# Altium schematic sheet DM3390_Connector_B.SchDoc: =project_title
size Tabloid; CompanyName: Luxonis Holding; Organization: Luxonis Holding; Address1: 1925 Harmony Park Drive; Address2: Westminster, CO; Address3: 80234; Address4: United States; SheetNumber: 8; SheetTotal: 12
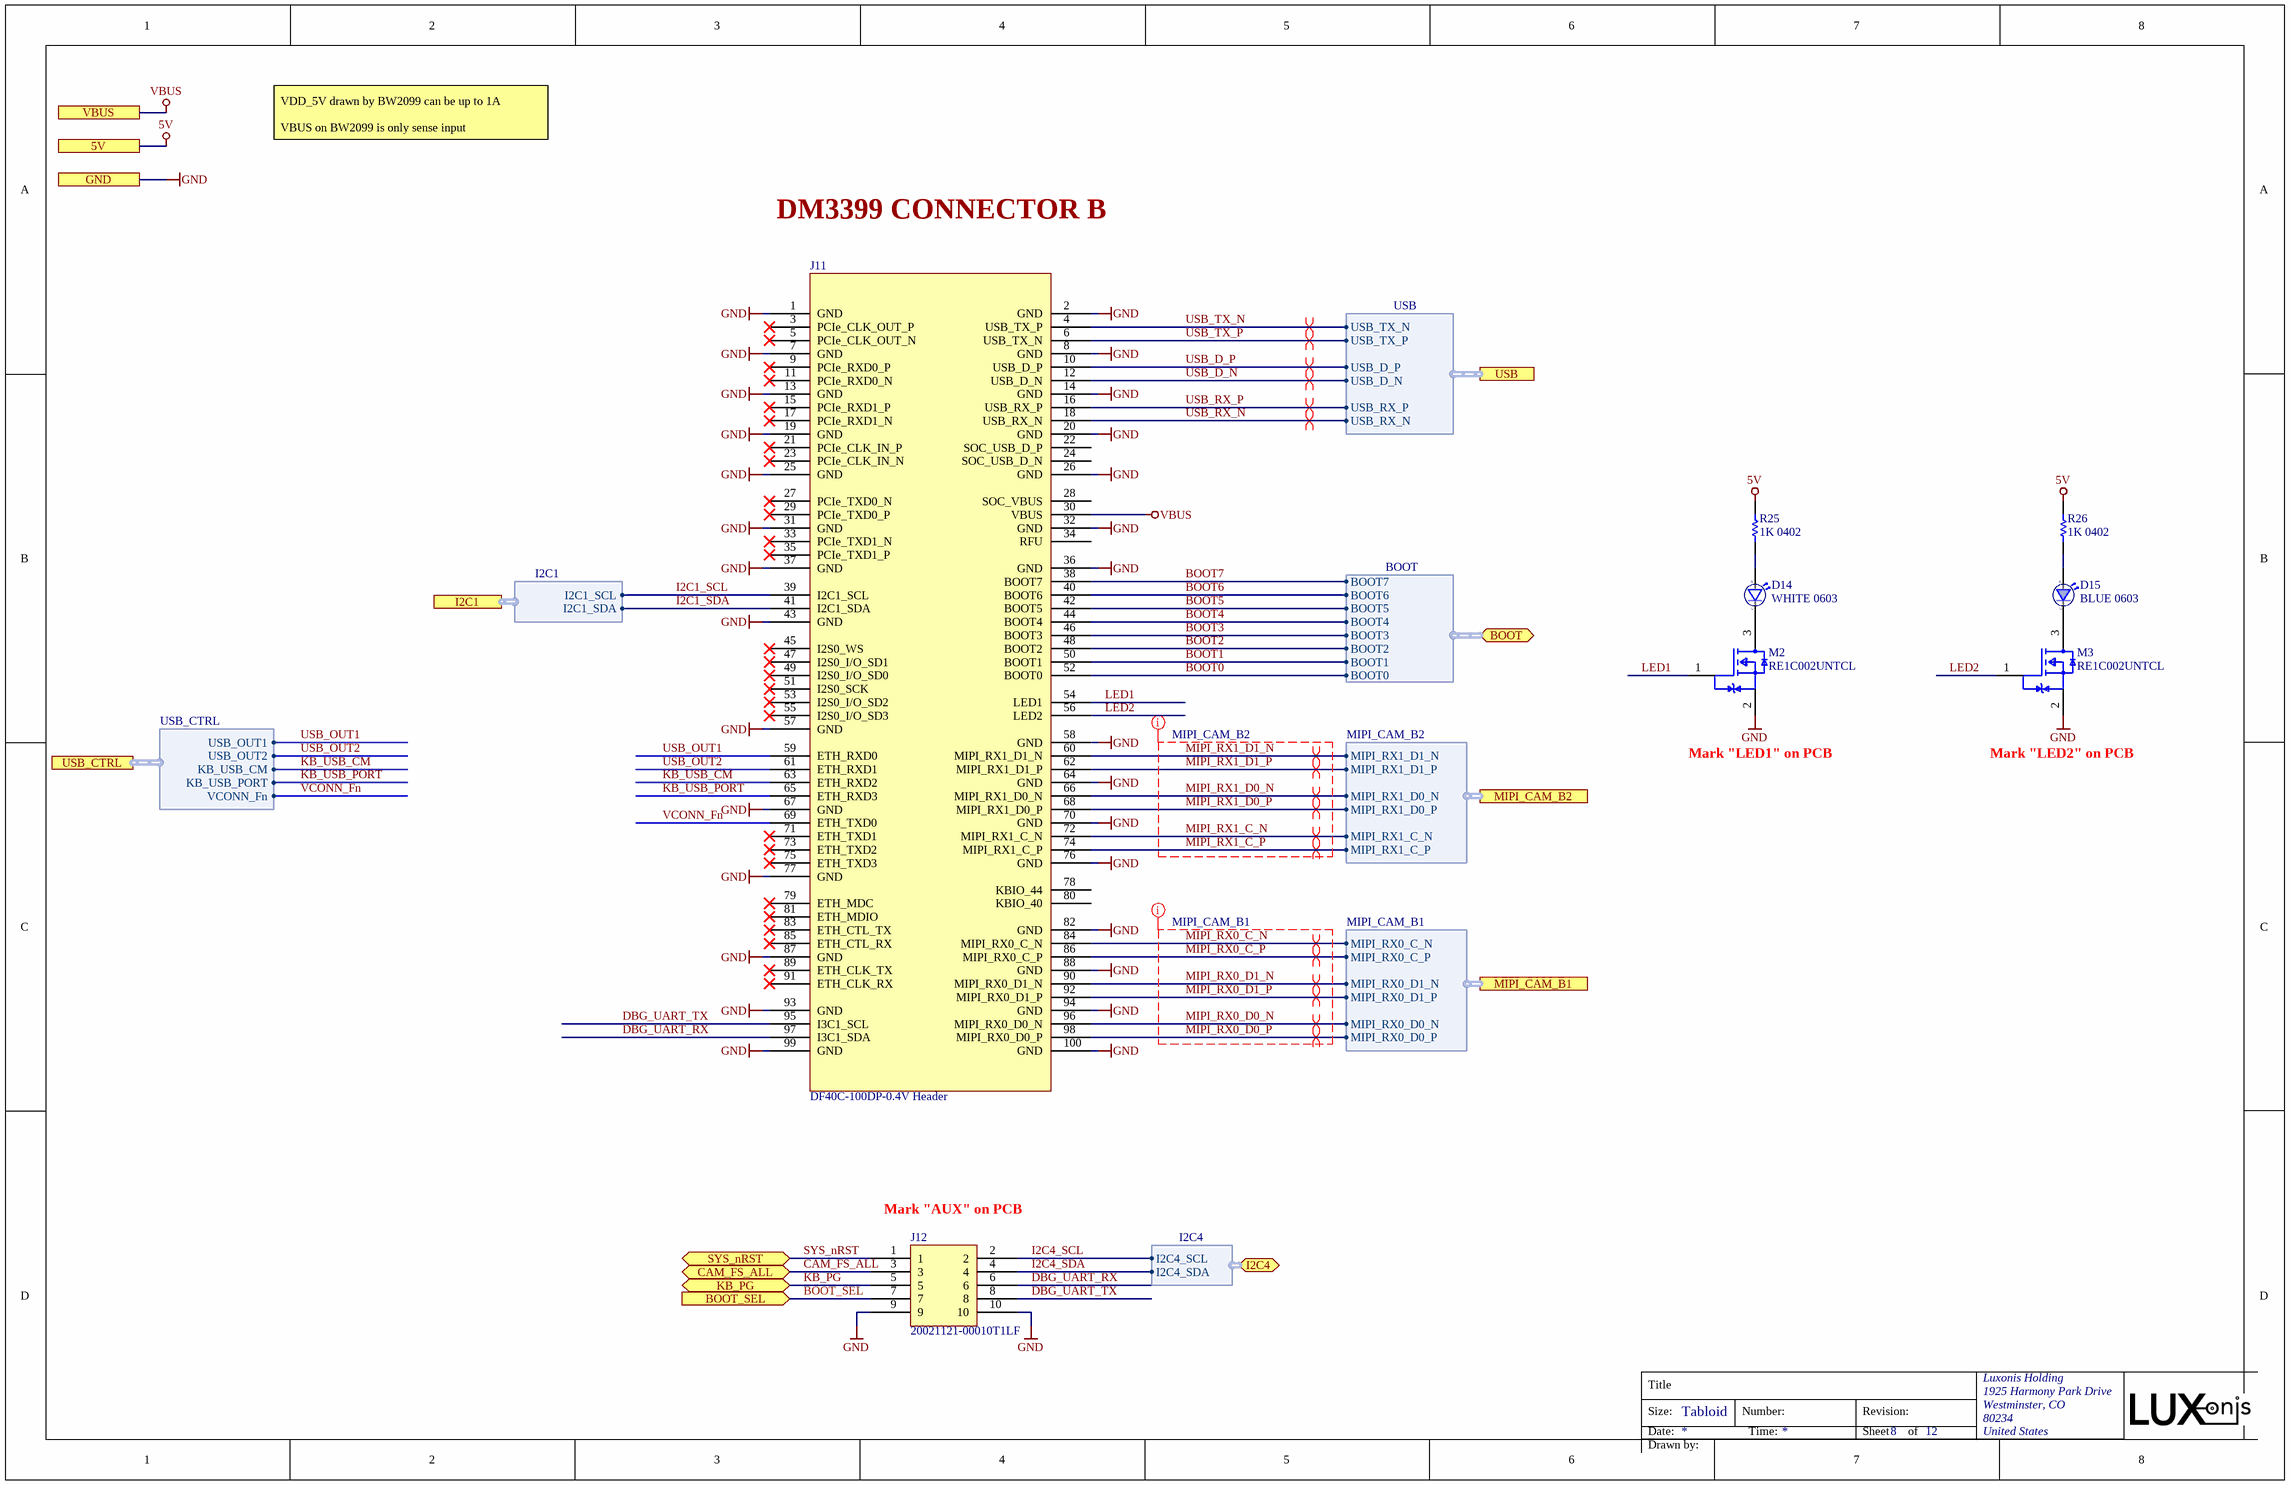
[diagram p0: DM3390_Connector_B.SchDoc]

## Parts
D14  WHITE 0603  [SML_D1xx8W]
D15  BLUE 0603  [SML_D1xx8W]
J11  DF40C-100DP-0.4V Header  [CON_B_SoM-MAX_DF40HC-3.0-100DS-0.4V_minpad]
J12  20021121-00010T1LF  [20021121-00010T1LF]
M2  RE1C002UNTCL  [RE1C002UNTCL]
M3  RE1C002UNTCL  [RE1C002UNTCL]
R25  1K 0402  [RESC0402(1005)_N]
R26  1K 0402  [RESC0402(1005)_N]

## Ports
5V, BOOT (bidir, harness BOOT), BOOT_SEL (in), CAM_FS_ALL (bidir), GND, I2C1 (harness I2C1), I2C4 (bidir, harness I2C4), KB_PG (bidir), MIPI_CAM_B1 (harness MIPI_CAM_B1), MIPI_CAM_B2 (harness MIPI_CAM_B2), SYS_nRST (bidir), USB (harness USB), USB_CTRL (harness USB_CTRL), VBUS

## Harnesses
USB: USB_D_P, USB_D_N, USB_TX_N, USB_TX_P, USB_RX_P, USB_RX_N
BOOT: BOOT4, BOOT3, BOOT2, BOOT1, BOOT0, BOOT5, BOOT6, BOOT7
MIPI_CAM_B2: MIPI_RX1_D1_N, MIPI_RX1_D1_P, MIPI_RX1_D0_N, MIPI_RX1_D0_P, MIPI_RX1_C_N, MIPI_RX1_C_P
MIPI_CAM_B1: MIPI_RX0_D1_N, MIPI_RX0_D1_P, MIPI_RX0_C_N, MIPI_RX0_C_P, MIPI_RX0_D0_N, MIPI_RX0_D0_P
I2C1: I2C1_SDA, I2C1_SCL
I2C4: I2C4_SCL, I2C4_SDA
USB_CTRL: USB_OUT1, USB_OUT2, KB_USB_CM, KB_USB_PORT, VCONN_Fn

## Nets
5V: R25.2 R26.2 ; port 5V
GND: J11.1(GND) J11.2(GND) J11.7(GND) J11.8(GND) J11.13(GND) J11.14(GND) J11.19(GND) J11.20(GND) J11.25(GND) J11.26(GND) J11.31(GND) J11.32(GND) J11.36(GND) J11.37(GND) J11.43(GND) J11.57(GND) J11.58(GND) J11.64(GND) J11.67(GND) J11.70(GND) J11.76(GND) J11.77(GND) J11.82(GND) J11.87(GND) J11.88(GND) J11.93(GND) J11.94(GND) J11.99(GND) J11.100(GND) J12.9 J12.10 M2.2(Source) M3.2(Source) ; port GND
VBUS: J11.30(VBUS) ; port VBUS
BOOT0: J11.52(BOOT0) ; port BOOT.BOOT0
BOOT1: J11.50(BOOT1) ; port BOOT.BOOT1
BOOT2: J11.48(BOOT2) ; port BOOT.BOOT2
BOOT3: J11.46(BOOT3) ; port BOOT.BOOT3
BOOT4: J11.44(BOOT4) ; port BOOT.BOOT4
BOOT5: J11.42(BOOT5) ; port BOOT.BOOT5
BOOT6: J11.40(BOOT6) ; port BOOT.BOOT6
BOOT7: J11.38(BOOT7) ; port BOOT.BOOT7
BOOT_SEL: J12.7 ; port BOOT_SEL
CAM_FS_ALL: J12.3 ; port CAM_FS_ALL
DBG_UART_RX: J11.97(I3C1_SDA) J12.6
DBG_UART_TX: J11.95(I3C1_SCL) J12.8
I2C1_SCL: J11.39(I2C1_SCL) ; port I2C1.I2C1_SCL
I2C1_SDA: J11.41(I2C1_SDA) ; port I2C1.I2C1_SDA
I2C4_SCL: J12.2 ; port I2C4.I2C4_SCL
I2C4_SDA: J12.4 ; port I2C4.I2C4_SDA
KB_PG: J12.5 ; port KB_PG
KB_USB_CM: J11.63(ETH_RXD2) ; port USB_CTRL.KB_USB_CM
KB_USB_PORT: J11.65(ETH_RXD3) ; port USB_CTRL.KB_USB_PORT
LED1: J11.54(LED1) M2.1(Gate)
LED2: J11.56(LED2) M3.1(Gate)
MIPI_RX0_C_N: J11.84(MIPI_RX0_C_N) ; port MIPI_CAM_B1.MIPI_RX0_C_N
MIPI_RX0_C_P: J11.86(MIPI_RX0_C_P) ; port MIPI_CAM_B1.MIPI_RX0_C_P
MIPI_RX0_D0_N: J11.96(MIPI_RX0_D0_N) ; port MIPI_CAM_B1.MIPI_RX0_D0_N
MIPI_RX0_D0_P: J11.98(MIPI_RX0_D0_P) ; port MIPI_CAM_B1.MIPI_RX0_D0_P
MIPI_RX0_D1_N: J11.90(MIPI_RX0_D1_N) ; port MIPI_CAM_B1.MIPI_RX0_D1_N
MIPI_RX0_D1_P: J11.92(MIPI_RX0_D1_P) ; port MIPI_CAM_B1.MIPI_RX0_D1_P
MIPI_RX1_C_N: J11.72(MIPI_RX1_C_N) ; port MIPI_CAM_B2.MIPI_RX1_C_N
MIPI_RX1_C_P: J11.74(MIPI_RX1_C_P) ; port MIPI_CAM_B2.MIPI_RX1_C_P
MIPI_RX1_D0_N: J11.66(MIPI_RX1_D0_N) ; port MIPI_CAM_B2.MIPI_RX1_D0_N
MIPI_RX1_D0_P: J11.68(MIPI_RX1_D0_P) ; port MIPI_CAM_B2.MIPI_RX1_D0_P
MIPI_RX1_D1_N: J11.60(MIPI_RX1_D1_N) ; port MIPI_CAM_B2.MIPI_RX1_D1_N
MIPI_RX1_D1_P: J11.62(MIPI_RX1_D1_P) ; port MIPI_CAM_B2.MIPI_RX1_D1_P
SYS_nRST: J12.1 ; port SYS_nRST
USB_D_N: J11.12(USB_D_N) ; port USB.USB_D_N
USB_D_P: J11.10(USB_D_P) ; port USB.USB_D_P
USB_OUT1: J11.59(ETH_RXD0) ; port USB_CTRL.USB_OUT1
USB_OUT2: J11.61(ETH_RXD1) ; port USB_CTRL.USB_OUT2
USB_RX_N: J11.18(USB_RX_N) ; port USB.USB_RX_N
USB_RX_P: J11.16(USB_RX_P) ; port USB.USB_RX_P
USB_TX_N: J11.4(USB_TX_P) ; port USB.USB_TX_N
USB_TX_P: J11.6(USB_TX_N) ; port USB.USB_TX_P
VCONN_Fn: J11.69(ETH_TXD0) ; port USB_CTRL.VCONN_Fn
NetD14_1: D14.1(C) M2.3(Drain)
NetD14_2: D14.2(A) R25.1
NetD15_1: D15.1(C) M3.3(Drain)
NetD15_2: D15.2(A) R26.1

Not connected (* = marked no-connect by the designer): J11 3(PCIe_CLK_OUT_P)* 5(PCIe_CLK_OUT_N)* 9(PCIe_RXD0_P)* 11(PCIe_RXD0_N)* 15(PCIe_RXD1_P)* 17(PCIe_RXD1_N)* 21(PCIe_CLK_IN_P)* 22(SOC_USB_D_P) 23(PCIe_CLK_IN_N)* 24(SOC_USB_D_N) 27(PCIe_TXD0_N)* 28(SOC_VBUS) 29(PCIe_TXD0_P)* 33(PCIe_TXD1_N)* 34(RFU) 35(PCIe_TXD1_P)* 45(I2S0_WS)* 47(I2S0_I/O_SD1)* 49(I2S0_I/O_SD0)* 51(I2S0_SCK)* 53(I2S0_I/O_SD2)* 55(I2S0_I/O_SD3)* 71(ETH_TXD1)* 73(ETH_TXD2)* 75(ETH_TXD3)* 78(KBIO_44) 79(ETH_MDC)* 80(KBIO_40) 81(ETH_MDIO)* 83(ETH_CTL_TX)* 85(ETH_CTL_RX)* 89(ETH_CLK_TX)* 91(ETH_CLK_RX)*

## Layout directives
differential pair; differential pair class 90ohm: USB_D_N, USB_D_P, USB_RX_N, USB_RX_P, USB_TX_N, USB_TX_P
differential pair; differential pair class 100ohm: MIPI_RX0_C_N, MIPI_RX0_C_P, MIPI_RX0_D0_N, MIPI_RX0_D0_P, MIPI_RX0_D1_N, MIPI_RX0_D1_P, MIPI_RX1_C_N, MIPI_RX1_C_P, MIPI_RX1_D0_N, MIPI_RX1_D0_P, MIPI_RX1_D1_N, MIPI_RX1_D1_P
net class MIPI_CAM_B2; rule Matched Net Lengths [Delay Tolerance = 1ps]; rule Matched Net Lengths [Delay Tolerance = 0,5ps]: MIPI_RX1_C_N, MIPI_RX1_C_P, MIPI_RX1_D0_N, MIPI_RX1_D0_P, MIPI_RX1_D1_N, MIPI_RX1_D1_P
net class MIPI_CAM_B1; rule Matched Net Lengths [Delay Tolerance = 1ps]; rule Matched Net Lengths [Delay Tolerance = 0,5ps]: MIPI_RX0_C_N, MIPI_RX0_C_P, MIPI_RX0_D0_N, MIPI_RX0_D0_P, MIPI_RX0_D1_N, MIPI_RX0_D1_P

## Notes on the sheet
- VDD_5V drawn by BW2099 can be up to 1A
  VBUS on BW2099 is only sense input
- DM3399 CONNECTOR B
- Mark "LED1" on PCB
- Mark "LED2" on PCB
- (near J12) Mark "AUX" on PCB
- Title
- Size:
- Date:
- Tabloid
- Number:
- Time:
- Revision:
- Sheet
- of
- Drawn by:

## Library data of the parts
D14 = SML-D12WBN1W1: LED Uni-Color White 2-Pin Chip 0603(1608Metric) T/R; Manufacturer 1: Rohm; Manufacturer Part Number 1: SMLD12WBN1W1; Supplier 1: RSComponents; RoHS: Yes; Category: LEDs; Stock 1: 1; Pricing 1: 30=0,53800, 150=0,45300, 300=0,40900 (USD); RoHS Compliant: Yes; ComponentLink1URL: https://www.rohm.com/datasheet/SMLD12WBN1W/smld12-e?src-supplier=Digi-Key; ComponentLink1Description: https://www.rohm.com/datasheet/SMLD12WBN1W/smld12-e?src-supplier=Digi-Key; Supplier Part Number 1: 1826302
D15 = SML-D12BN1WT86: LED Uni-Color Blue 2-Pin Chip 0603(1608Metric) T/R; Manufacturer 1: Rohm; Manufacturer Part Number 1: SMLD12BN1WT86; Supplier 1: Newark; RoHS: Yes; Category: LEDs; Stock 1: 2992; Pricing 1: 1=1,01000, 10=0,66800, 25=0,59200, 50=0,51800, 100=0,44200 (USD); RoHS Compliant: Yes; ComponentLink1URL: http://www.farnell.com/datasheets/2711924.pdf?src-supplier=Newark; ComponentLink1Description: http://www.farnell.com/datasheets/2711924.pdf?src-supplier=Newark; Supplier Part Number 1: 84AC7329
J11 = DF40HC(3.0)-100DS-0.4V_OAK-SoM-MAX_B: CONN HDR 100POS 0.4MM SMD GOLD BW2099 SYMBOL; Manufacturer Part Number 1: DF40C-100DP-0.4V(51); mfg: Hirose; mated_height: 1.5mm; pin_current: 0.3A; Number of Contacts: 100; Voltage Rating: 30V; Current Rating: 300mA; Connector Type: Plug; Contact Resistance: 90mR; Gender: Male; Mated Stacking Heights: 4mm; pin_pitch: 0.4mm; mating_connector: DF40C-100DP-0.4V; mfg_pn: DF40C-100DP-0.4V; Supplier 1: Digi-Key; Manufacturer 1: Hirose; Stock 1: 10165; Pricing 1: 1=1.66000, 10=1.50900, 25=1.41680, 50=1.35520, 100=1.29360, 250=1.17040, 500=1.07800, 1000=0.92400 (USD); RoHS: Yes; Mount: Surface Mount; Contact Plating: Gold; Contact Material: Bronze; Housing Color: Black; Housing Material: Polymer; Min Operating Temperature: -35°C; Max Operating Temperature: 85°C; Number of Rows: 2; Termination: SMD/SMT; Package Quantity: 1; Packaging: Tape and Reel; Number of Positions: 100; Orientation: Straight; Max Current Rating: 300mA; Max Voltage Rating (AC): 30V; Length: 21.52mm; Pitch: 0.4mm; Depth: 1.85mm; Stack Height: 1.5mm; Radiation Hardening: No; REACH SVHC: Unknown; Lead Free: Lead Free; ComponentLink1URL: https://datasheet.ciiva.com/26948/getdatasheetpartid-434445-26948932.pdf?src-supplier=Verical; ComponentLink1Description: https://datasheet.ciiva.com/26948/getdatasheetpartid-434445-26948932.pdf?src-supplier=Verical; ComponentLink2URL: https://datasheet.ciiva.com/46408/1824826-46408893.pdf?src-supplier=Element14; ComponentLink2Description: https://datasheet.ciiva.com/46408/1824826-46408893.pdf?src-supplier=Element14; ComponentLink3URL: http://datasheet.octopart.com/DF40C-100DP-0.4V%2851%29-Hirose-datasheet-12512482.pdf?src-supplier=Newark; ComponentLink3Description: http://datasheet.octopart.com/DF40C-100DP-0.4V%2851%29-Hirose-datasheet-12512482.pdf?src-supplier=Newark; ComponentLink4URL: http://datasheet.octopart.com/DF40C-100DP-0.4V%2851%29-Hirose-datasheet-24967586.pdf?src-supplier=Element14; ComponentLink4Description: http://datasheet.octopart.com/DF40C-100DP-0.4V%2851%29-Hirose-datasheet-24967586.pdf?src-supplier=Element14; ComponentLink5URL: http://datasheet.octopart.com/DF40C-100DP-0.4V%2851%29-Hirose-datasheet-8329537.pdf?src-supplier=Factory+Futures; ComponentLink5Description: http://datasheet.octopart.com/DF40C-100DP-0.4V%2851%29-Hirose-datasheet-8329537.pdf?src-supplier=Factory+Futures; ComponentLink6URL: http://datasheet.octopart.com/DF40C-100DP-0.4V%2851%29-Hirose-datasheet-62290554.pdf?src-supplier=Future+Electronics; ComponentLink6Description: http://datasheet.octopart.com/DF40C-100DP-0.4V%2851%29-Hirose-datasheet-62290554.pdf?src-supplier=Future+Electronics; ComponentLink7URL: http://datasheet.octopart.com/DF40C-100DP-0.4V%2851%29-Hirose-datasheet-130255728.pdf?src-supplier=Future+Electronics; ComponentLink7Description: http://datasheet.octopart.com/DF40C-100DP-0.4V%2851%29-Hirose-datasheet-130255728.pdf?src-supplier=Future+Electronics; Supplier Part Number 1: H11614CT-ND; Supplier 2: Mouser; Supplier Part Number 2: 798-DF40C100DP0.4V51
J12 = 20021121-00010T1LF: CONN HEADER SMD 10POS 1.27MM; Manufacturer 1: Amphenol FCI; Number of Contacts: 10; Contact Resistance: 30mR; Max Voltage Rating (AC): 125V; Connector Type: Male Pin; Row Spacing: 0.05inch; Supplier 1: Digi-Key; Manufacturer Part Number 1: 20021121-00010T1LF; Stock 1: 1465; Pricing 1: 1=0.77000, 10=0.71800, 100=0.55040, 500=0.47860, 1000=0.39485, 5000=0.34699, 10000=0.32306 (USD); RoHS: Yes; Mount: Surface Mount; Contact Plating: Gold; Color: Black; Contact Material: Copper Alloy; Housing Color: Black; Housing Material: Thermoplastic; Min Operating Temperature: -40°C; Max Operating Temperature: 85°C; Number of Rows: 2; Termination: Solder; Package Quantity: 93; Packaging: Rail/Tube; Number of Positions: 10; Orientation: Straight; Length: 6.35mm; Pitch: 1.27mm; Contact Mating Length: 0.12inch; Depth: 3.4mm; ComponentLink1URL: https://datasheet.ciiva.com/18659/20021121-18659066.pdf?src-supplier=Digi-Key; ComponentLink1Description: https://datasheet.ciiva.com/18659/20021121-18659066.pdf?src-supplier=Digi-Key; ComponentLink2URL: https://datasheet.ciiva.com/10033/20021121-10033582.pdf?src-supplier=Avnet; ComponentLink2Description: https://datasheet.ciiva.com/10033/20021121-10033582.pdf?src-supplier=Avnet; Supplier Part Number 1: 609-6529-ND; Supplier 2: Mouser; Supplier 3: TTI; Supplier Part Number 2: 649-200211210010T1LF; Supplier Part Number 3: 20021121-00010T1LF
M2 M3 = RE1C002UNTCL: MOSFET N-CH 20V 0.2A EMT3; Manufacturer 1: Rohm; Continuous Drain Current (ID): 200mA; Rds On Max: 1.2R; Input Capacitance: 25pF; Max Power Dissipation: 150mW; RoHS: Yes; Mount: Surface Mount; Case/Package: SOT-89; Packaging: Tape and Reel; Drain to Source Voltage (Vdss): 20V; Lead Free: Lead Free; ComponentLink1URL: http://www.mouser.com/ds/2/348/re1c002untcl-e-1018231.pdf?src-supplier=Mouser; ComponentLink1Description: http://www.mouser.com/ds/2/348/re1c002untcl-e-1018231.pdf?src-supplier=Mouser; ComponentLink2URL: http://rohmfs.rohm.com/en/techdata_basic/transistor/taping/EMT3_TL_taping.pdf?src-supplier=Digi-Key; ComponentLink2Description: http://rohmfs.rohm.com/en/techdata_basic/transistor/taping/EMT3_TL_taping.pdf?src-supplier=Digi-Key; ComponentLink3URL: http://rohmfs.rohm.com/en/products/databook/datasheet/discrete/transistor/mosfet/re1c002un.pdf?src-supplier=Avnet; ComponentLink3Description: http://rohmfs.rohm.com/en/products/databook/datasheet/discrete/transistor/mosfet/re1c002un.pdf?src-supplier=Avnet; ComponentLink4URL: https://www.rohm.com/datasheet/RE1C002UN/re1c002untcl-e?src-supplier=Digi-Key; ComponentLink4Description: https://www.rohm.com/datasheet/RE1C002UN/re1c002untcl-e?src-supplier=Digi-Key; ComponentLink5URL: http://www.farnell.com/datasheets/2704376.pdf?src-supplier=Newark; ComponentLink5Description: http://www.farnell.com/datasheets/2704376.pdf?src-supplier=Newark; ComponentLink6URL: http://www.farnell.com/datasheets/2704376.pdf?src-supplier=Farnell; ComponentLink6Description: http://www.farnell.com/datasheets/2704376.pdf?src-supplier=Farnell; ComponentLink7URL: http://www.farnell.com/datasheets/2704376.pdf?src-supplier=Element14; ComponentLink7Description: http://www.farnell.com/datasheets/2704376.pdf?src-supplier=Element14; Supplier 1: Digi-Key; Manufacturer Part Number 1: RE1C002UNTCL; Stock 1: 868886; Pricing 1: 1=0.20000, 10=0.18200, 100=0.09930, 500=0.06112, 1000=0.04167 (USD); Supplier Part Number 1: RE1C002UNTCLCT-ND
R25 R26 = RC0402FR-071KL: RES SMD 1K OHM 1% 1/16W 0402 1 kOhms ±1% 0.063W, 1/16W Chip Resistor 0402 (1005 Metric) Moisture Resistant Thick Film; Manufacturer 1: Yageo; Temperature Coefficient: 100ppm/°C; Power Rating: 62.5mW; Voltage Rating (DC): 50V; Resistance: 1kR; RoHS: Yes; Number of Pins: 2; Case Code (Imperial): 0402; Case Code (Metric): 1005; Min Operating Temperature: -55°C; Max Operating Temperature: 155°C; Packaging: Tape and Reel; Composition: Thick Film; Voltage Rating: 50V; Military Standard: Not; Termination: SMD/SMT; Length: 1mm; Height: 0.32mm; Width: 0.5mm; Depth: 0.5mm; Lead Free: Lead Free; REACH SVHC: Unknown; ComponentLink1URL: https://datasheet.ciiva.com/11819/0900766b80c66297-11819477.pdf?src-supplier=RSComponents; ComponentLink1Description: https://datasheet.ciiva.com/11819/0900766b80c66297-11819477.pdf?src-supplier=RSComponents; ComponentLink2URL: https://datasheet.ciiva.com/12666/pyu-rc0402-51-rohs-l-6-r-12666741.pdf?src-supplier=Mouser; ComponentLink2Description: https://datasheet.ciiva.com/12666/pyu-rc0402-51-rohs-l-6-r-12666741.pdf?src-supplier=Mouser; ComponentLink3URL: https://datasheet.ciiva.com/17063/pyu-rc0402-51-rohs-l-6-r-17063193.pdf?src-supplier=Future+Electronics; ComponentLink3Description: https://datasheet.ciiva.com/17063/pyu-rc0402-51-rohs-l-6-r-17063193.pdf?src-supplier=Future+Electronics; ComponentLink4URL: https://datasheet.ciiva.com/22747/1018594-22747513.pdf?src-supplier=Element14; ComponentLink4Description: https://datasheet.ciiva.com/22747/1018594-22747513.pdf?src-supplier=Element14; ComponentLink5URL: https://datasheet.ciiva.com/7849/1018594-7849869.pdf?src-supplier=Element14; ComponentLink5Description: https://datasheet.ciiva.com/7849/1018594-7849869.pdf?src-supplier=Element14; ComponentLink6URL: https://datasheet.ciiva.com/7983/1018594-7983502.pdf?src-supplier=Element14; ComponentLink6Description: https://datasheet.ciiva.com/7983/1018594-7983502.pdf?src-supplier=Element14; ComponentLink7URL: https://datasheet.ciiva.com/7849/1018594-7849871.pdf?src-supplier=Element14; ComponentLink7Description: https://datasheet.ciiva.com/7849/1018594-7849871.pdf?src-supplier=Element14; Supplier 1: Digi-Key; Manufacturer Part Number 1: RC0402FR-071KL; Stock 1: 60695854; Pricing 1: 1=0.10000, 10=0.01600, 100=0.00670, 1000=0.00301, 2500=0.00261, 5000=0.00215 (USD); Case/Package: 0402; Tolerance: 1%; Supplier Part Number 1: 311-1.00KLRCT-ND